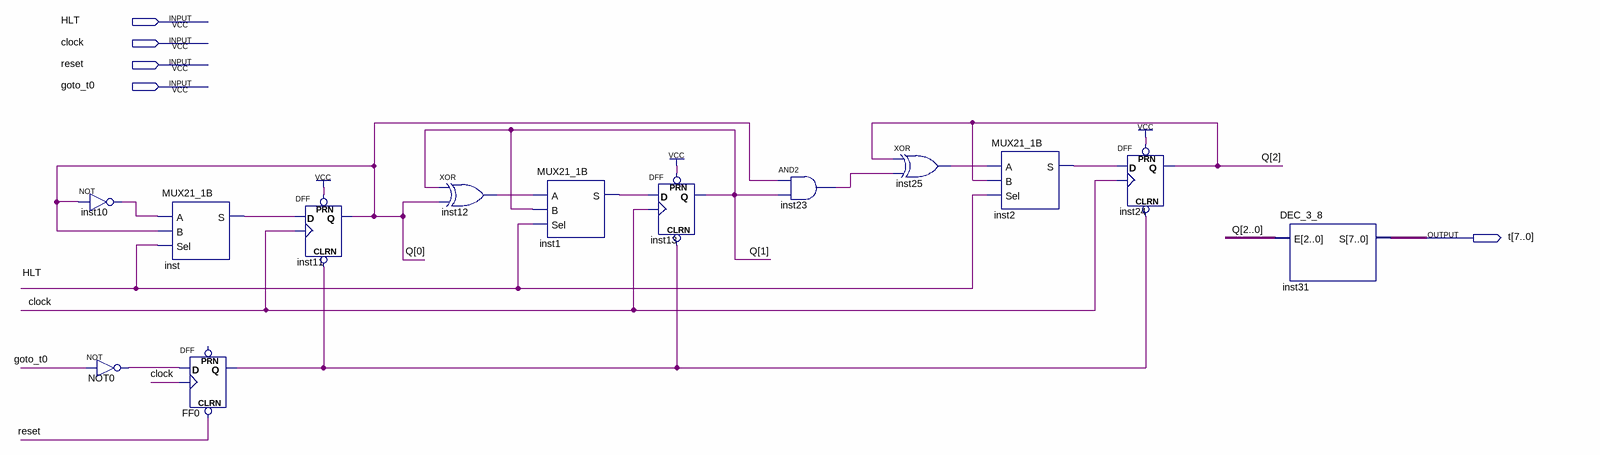
[diagram p0: schematic sheet]
// Quartus schematic TEMPORIZADOR.bdf as structural Verilog: 13 symbols, 5 pins
module TEMPORIZADOR (
  input  HLT,
  input  clock,
  input  reset,
  input  goto_t0,
  output [7:0] t
);

  wire FF0_q, inst1_s, inst2_s, inst10_out, inst12_out, inst23_out, inst25_out, inst_s, NOT0_out;
  wire [2:0] Q;

  not inst10 (inst10_out, Q[0]);
  not NOT0 (NOT0_out, goto_t0);
  MUX21_1B inst (.A(inst10_out), .B(Q[0]), .Sel(HLT), .S(inst_s));
  DFF FF0 (.CLRN(reset), .CLK(clock), .D(NOT0_out), .Q(FF0_q));  // open: PRN
  DFF inst11 (.CLRN(FF0_q), .CLK(clock), .D(inst_s), .PRN(1'b1), .Q(Q[0]));
  xor inst12 (inst12_out, Q[1], Q[0]);
  MUX21_1B inst1 (.A(inst12_out), .B(Q[1]), .Sel(HLT), .S(inst1_s));
  DFF inst13 (.CLRN(FF0_q), .CLK(clock), .D(inst1_s), .PRN(1'b1), .Q(Q[1]));
  and inst23 (inst23_out, Q[0], Q[1]);
  xor inst25 (inst25_out, Q[2], inst23_out);
  MUX21_1B inst2 (.A(inst25_out), .B(Q[2]), .Sel(HLT), .S(inst2_s));
  DFF inst24 (.CLRN(FF0_q), .CLK(clock), .D(inst2_s), .PRN(1'b1), .Q(Q[2]));
  DEC_3_8 inst31 (.E(Q), .S(t));
endmodule
